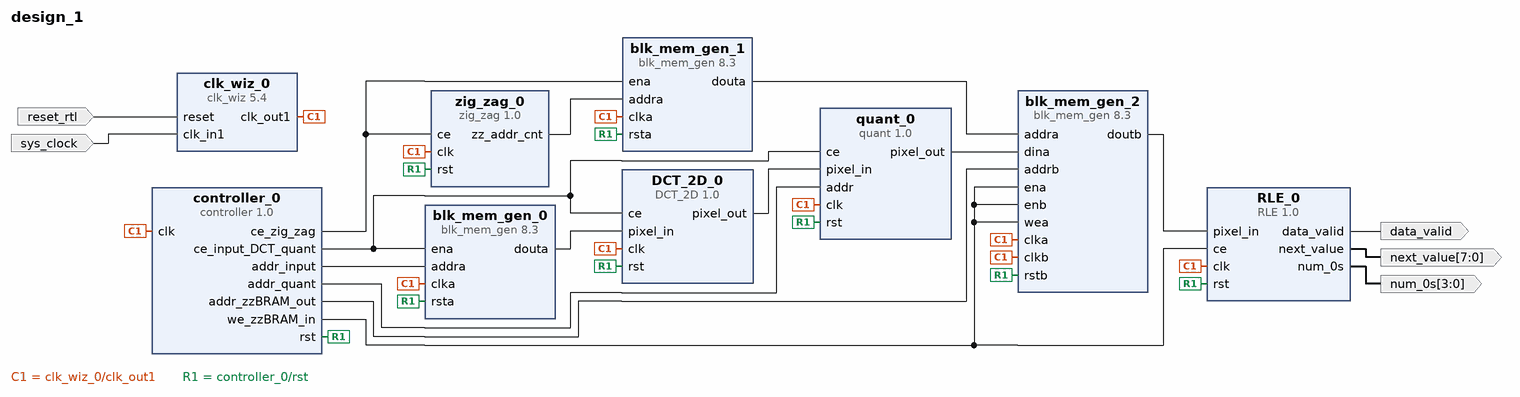
[diagram p0: block diagram of the top level]
# Vivado block design design_1, xc7z010clg400-1, Vivado 2017.2
create_bd_design design_1

create_bd_port -dir I -type rst reset_rtl
set_property -dict {CONFIG.POLARITY ACTIVE_HIGH} [get_bd_ports reset_rtl]
create_bd_port -dir I -type clk sys_clock
set_property -dict {CONFIG.FREQ_HZ 125000000 CONFIG.PHASE 0.000} [get_bd_ports sys_clock]
create_bd_port -dir O -from 3 -to 0 num_0s
create_bd_port -dir O -from 7 -to 0 next_value
create_bd_port -dir O data_valid

create_bd_cell -type ip -vlnv xilinx.com:ip:clk_wiz:5.4 clk_wiz_0
set_property -dict [list \
  CONFIG.PRIMITIVE PLL \
  CONFIG.CLKOUT1_REQUESTED_OUT_FREQ 31.000 \
  CONFIG.CLKOUT1_DRIVES BUFG \
  CONFIG.CLKOUT2_DRIVES BUFG \
  CONFIG.CLKOUT3_DRIVES BUFG \
  CONFIG.CLKOUT4_DRIVES BUFG \
  CONFIG.CLKOUT5_DRIVES BUFG \
  CONFIG.CLKOUT6_DRIVES BUFG \
  CONFIG.CLKOUT7_DRIVES BUFG \
  CONFIG.USE_LOCKED false \
  CONFIG.MMCM_DIVCLK_DIVIDE 5 \
  CONFIG.MMCM_CLKFBOUT_MULT_F 62 \
  CONFIG.MMCM_COMPENSATION ZHOLD \
  CONFIG.MMCM_CLKOUT0_DIVIDE_F 50 \
  CONFIG.USE_BOARD_FLOW true \
  CONFIG.CLK_IN1_BOARD_INTERFACE sys_clock \
  CONFIG.CLKOUT1_JITTER 155.040 \
  CONFIG.CLKOUT1_PHASE_ERROR 225.564 \
] [get_bd_cells clk_wiz_0]
create_bd_cell -type ip -vlnv domain.local:user:controller:1.0 controller_0
create_bd_cell -type ip -vlnv domain.local:user:DCT_2D:1.0 DCT_2D_0
create_bd_cell -type ip -vlnv xilinx.com:ip:blk_mem_gen:8.3 blk_mem_gen_0
set_property -dict [list \
  CONFIG.Memory_Type Single_Port_ROM \
  CONFIG.Enable_32bit_Address false \
  CONFIG.Write_Width_A 8 \
  CONFIG.Write_Depth_A 64 \
  CONFIG.Register_PortA_Output_of_Memory_Primitives true \
  CONFIG.Load_Init_File true \
  CONFIG.Coe_File ../../../../../../../component_modules/DCT/DCT.ip_user_files/inputData.coe \
  CONFIG.Use_RSTA_Pin true \
  CONFIG.Port_A_Write_Rate 0 \
  CONFIG.use_bram_block Stand_Alone \
] [get_bd_cells blk_mem_gen_0]
create_bd_cell -type ip -vlnv domain.local:user:quant:1.0 quant_0
create_bd_cell -type ip -vlnv xilinx.com:ip:blk_mem_gen:8.3 blk_mem_gen_1
set_property -dict [list \
  CONFIG.Memory_Type Single_Port_ROM \
  CONFIG.Enable_32bit_Address false \
  CONFIG.Write_Width_A 8 \
  CONFIG.Write_Depth_A 64 \
  CONFIG.Register_PortA_Output_of_Memory_Primitives true \
  CONFIG.Load_Init_File true \
  CONFIG.Coe_File ../../../../../../../component_modules/zig_zag/zig_zag_addr_tableT.coe \
  CONFIG.Use_RSTA_Pin true \
  CONFIG.Port_A_Write_Rate 0 \
  CONFIG.use_bram_block Stand_Alone \
] [get_bd_cells blk_mem_gen_1]
create_bd_cell -type ip -vlnv xilinx.com:ip:blk_mem_gen:8.3 blk_mem_gen_2
set_property -dict [list \
  CONFIG.Memory_Type Simple_Dual_Port_RAM \
  CONFIG.Enable_32bit_Address false \
  CONFIG.Use_Byte_Write_Enable false \
  CONFIG.Write_Width_A 8 \
  CONFIG.Write_Depth_A 255 \
  CONFIG.Operating_Mode_A NO_CHANGE \
  CONFIG.Write_Width_B 8 \
  CONFIG.Read_Width_B 8 \
  CONFIG.Enable_B Use_ENB_Pin \
  CONFIG.Register_PortB_Output_of_Memory_Primitives true \
  CONFIG.Use_RSTB_Pin true \
  CONFIG.Port_B_Clock 100 \
  CONFIG.Port_B_Enable_Rate 100 \
  CONFIG.use_bram_block Stand_Alone \
] [get_bd_cells blk_mem_gen_2]
create_bd_cell -type ip -vlnv domain.local:user:RLE:1.0 RLE_0
create_bd_cell -type ip -vlnv domain.local:user:zig_zag:1.0 zig_zag_0

# ---- connections ----

connect_bd_net [get_bd_ports reset_rtl] [get_bd_pins clk_wiz_0/reset]
connect_bd_net [get_bd_ports sys_clock] [get_bd_pins clk_wiz_0/clk_in1]
connect_bd_net [get_bd_pins clk_wiz_0/clk_out1] \
  [get_bd_pins controller_0/clk] [get_bd_pins DCT_2D_0/clk] [get_bd_pins blk_mem_gen_0/clka] [get_bd_pins quant_0/clk] \
  [get_bd_pins blk_mem_gen_1/clka] [get_bd_pins blk_mem_gen_2/clka] [get_bd_pins blk_mem_gen_2/clkb] [get_bd_pins RLE_0/clk] \
  [get_bd_pins zig_zag_0/clk]
connect_bd_net [get_bd_pins controller_0/addr_input] [get_bd_pins blk_mem_gen_0/addra]
connect_bd_net [get_bd_pins controller_0/ce_input_DCT_quant] [get_bd_pins blk_mem_gen_0/ena] [get_bd_pins DCT_2D_0/ce] [get_bd_pins quant_0/ce]
connect_bd_net [get_bd_pins controller_0/rst] \
  [get_bd_pins blk_mem_gen_0/rsta] [get_bd_pins DCT_2D_0/rst] [get_bd_pins quant_0/rst] [get_bd_pins blk_mem_gen_1/rsta] \
  [get_bd_pins blk_mem_gen_2/rstb] [get_bd_pins RLE_0/rst] [get_bd_pins zig_zag_0/rst]
connect_bd_net [get_bd_pins blk_mem_gen_0/douta] [get_bd_pins DCT_2D_0/pixel_in]
connect_bd_net [get_bd_pins DCT_2D_0/pixel_out] [get_bd_pins quant_0/pixel_in]
connect_bd_net [get_bd_pins controller_0/addr_quant] [get_bd_pins quant_0/addr]
connect_bd_net [get_bd_pins zig_zag_0/zz_addr_cnt] [get_bd_pins blk_mem_gen_1/addra]
connect_bd_net [get_bd_pins quant_0/pixel_out] [get_bd_pins blk_mem_gen_2/dina]
connect_bd_net [get_bd_pins blk_mem_gen_1/douta] [get_bd_pins blk_mem_gen_2/addra]
connect_bd_net [get_bd_pins controller_0/addr_zzBRAM_out] [get_bd_pins blk_mem_gen_2/addrb]
connect_bd_net [get_bd_pins controller_0/ce_zig_zag] [get_bd_pins blk_mem_gen_1/ena] [get_bd_pins zig_zag_0/ce]
connect_bd_net [get_bd_pins controller_0/we_zzBRAM_in] \
  [get_bd_pins blk_mem_gen_2/wea] [get_bd_pins blk_mem_gen_2/ena] [get_bd_pins blk_mem_gen_2/enb] [get_bd_pins RLE_0/ce]
connect_bd_net [get_bd_pins blk_mem_gen_2/doutb] [get_bd_pins RLE_0/pixel_in]
connect_bd_net [get_bd_pins RLE_0/num_0s] [get_bd_ports num_0s]
connect_bd_net [get_bd_pins RLE_0/next_value] [get_bd_ports next_value]
connect_bd_net [get_bd_pins RLE_0/data_valid] [get_bd_ports data_valid]

validate_bd_design
save_bd_design
